# Altium schematic sheet GR_Split.SchDoc
size A4
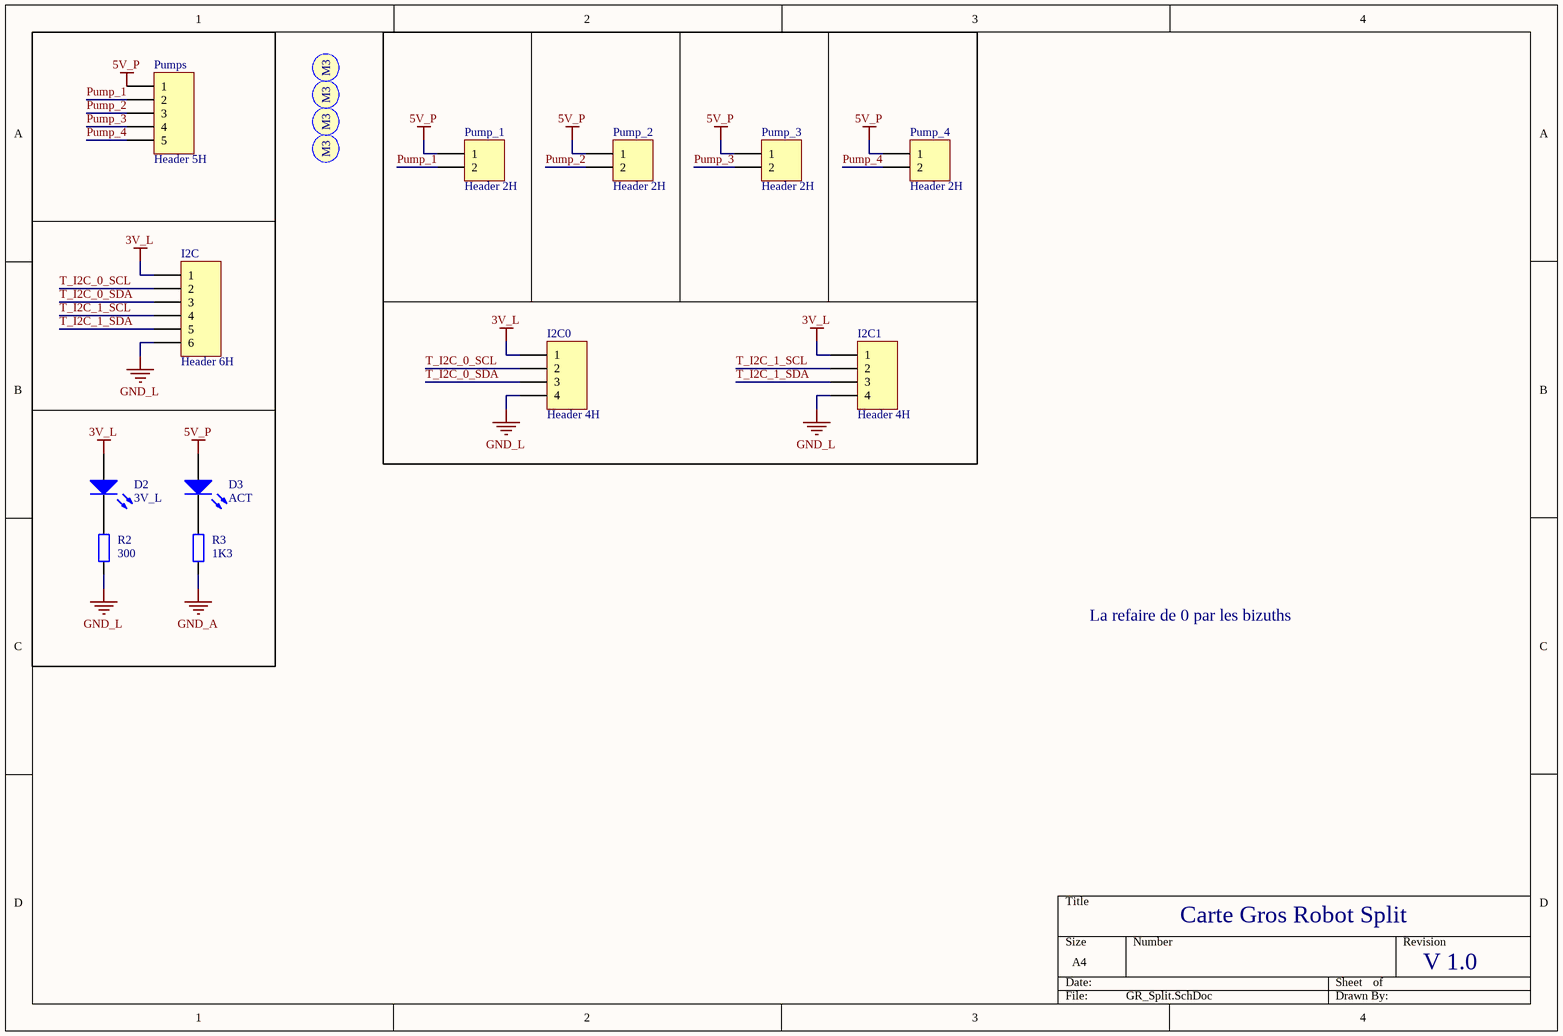
[diagram p0: GR_Split.SchDoc]

## Parts
D2  3V_L  [KP-3216SEC]
D3  ACT  [KP-3216SEC]
I2C  Header 6H  [B6B-XH-A]
I2C0  Header 4H  [B4B-XH-A]
I2C1  Header 4H  [B4B-XH-A]
Pump_1  Header 2H  [S2B-XH-A]
Pump_2  Header 2H  [S2B-XH-A]
Pump_3  Header 2H  [S2B-XH-A]
Pump_4  Header 2H  [S2B-XH-A]
Pumps  Header 5H  [HDR1X5H]
R2  value 300  [Resistor 1206]  (hidden comment: Res2)
R3  value 1K3  [Resistor 1206]  (hidden comment: Res2)
S1  Screw M3  [Screw M3]  (value not drawn)
S2  Screw M3  [Screw M3]  (value not drawn)
S3  Screw M3  [Screw M3]  (value not drawn)
S4  Screw M3  [Screw M3]  (value not drawn)

## Nets
3V_L: D2.1(A) I2C.1 I2C0.1 I2C1.1
5V_P: D3.1(A) Pump_1.1 Pump_2.1 Pump_3.1 Pump_4.1 Pumps.1
GND_A: R3.2
GND_L: I2C.6 I2C0.4 I2C1.4 R2.1
Pump_1: Pump_1.2 Pumps.2
Pump_2: Pump_2.2 Pumps.3
Pump_3: Pump_3.2 Pumps.4
Pump_4: Pump_4.2 Pumps.5
T_I2C_0_SCL: I2C.2 I2C0.2
T_I2C_0_SDA: I2C.3 I2C0.3
T_I2C_1_SCL: I2C.4 I2C1.2
T_I2C_1_SDA: I2C.5 I2C1.3
NetD2_2: D2.2(K) R2.2
NetD3_2: D3.2(K) R3.1

## Notes on the sheet
- La refaire de 0 par les bizuths
- Carte Gros Robot Split
- V 1.0
- (in symbol Screw M3) M3

## Library data of the parts
D2 D3 = LED2: Typical RED, GREEN, YELLOW, AMBER GaAs LED; Published: 8-Jun-2000; LatestRevisionDate: 17-Jul-2002; LatestRevisionNote: Re-released for DXP Platform.; PackageVersion: Feb-2002; PackageReference: 3.2X1.6X1.1; Publisher: Altium Limited; PackageDescription: SM LED; 2 Flat Leads
I2C = Header 6H: Header, 6-Pin, Right Angle; LatestRevisionDate: 17-Jul-2002; LatestRevisionNote: Re-released for DXP Platform.; Publisher: Altium Limited
I2C0 I2C1 = Header 4H: Header, 4-Pin, Right Angle; LatestRevisionDate: 17-Jul-2002; LatestRevisionNote: Re-released for DXP Platform.; Publisher: Altium Limited
Pump_1-Pump_4 = Header 2H: Header, 2-Pin, Right Angle; LatestRevisionDate: 17-Jul-2002; LatestRevisionNote: Re-released for DXP Platform.; Publisher: Altium Limited
Pumps = Header 5H: Header, 5-Pin, Right Angle; LatestRevisionDate: 17-Jul-2002; LatestRevisionNote: Re-released for DXP Platform.; Publisher: Altium Limited
R2 R3 = Res2: Resistor; Published: 8-Jun-2000; LatestRevisionDate: 17-Jul-2002; LatestRevisionNote: Re-released for DXP Platform.; PackageReference: AXIAL-0.4; Publisher: Altium Limited; PackageDescription: Axial Device, Thru-Hole; 2 Leads; 0.4 in Pin Spacing